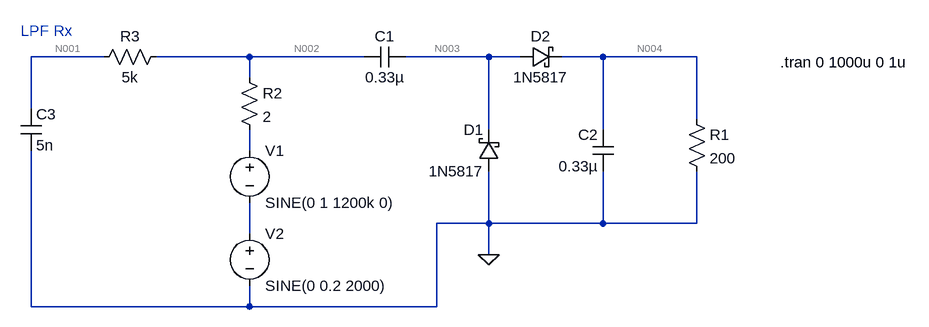
[diagram p0: schematic VoltageDoubler.asc]
VoltageDoubler.asc, the LTspice schematic file:
Version 4
SHEET 1 960 680
WIRE -304 48 -416 48
WIRE -80 48 -224 48
WIRE 96 48 -80 48
WIRE 288 48 160 48
WIRE 336 48 288 48
WIRE 464 48 400 48
WIRE 608 48 464 48
WIRE -80 80 -80 48
WIRE -416 128 -416 48
WIRE 608 144 608 48
WIRE 288 160 288 48
WIRE 464 160 464 48
WIRE -80 192 -80 160
WIRE 288 304 288 224
WIRE 288 304 208 304
WIRE 464 304 464 224
WIRE 464 304 288 304
WIRE 608 304 608 224
WIRE 608 304 464 304
WIRE -80 320 -80 272
WIRE 288 352 288 304
WIRE -416 432 -416 192
WIRE -80 432 -80 400
WIRE -80 432 -416 432
WIRE 208 432 208 304
WIRE 208 432 -80 432
FLAG 288 352 0
SYMBOL voltage -80 176 R0
WINDOW 123 0 0 Left 0
WINDOW 39 0 0 Left 0
SYMATTR InstName V1
SYMATTR Value SINE(0 1 1200k 0)
SYMBOL cap 160 32 R90
WINDOW 0 0 32 VBottom 2
WINDOW 3 32 32 VTop 2
SYMATTR InstName C1
SYMATTR Value 0.33µ
SYMBOL cap 480 224 R180
WINDOW 0 24 56 Left 2
WINDOW 3 24 8 Left 2
SYMATTR InstName C2
SYMATTR Value 0.33µ
SYMBOL schottky 304 224 R180
WINDOW 0 24 64 Left 2
WINDOW 3 24 0 Left 2
SYMATTR InstName D1
SYMATTR Value 1N5817
SYMATTR Description Diode
SYMATTR Type diode
SYMBOL schottky 336 64 R270
WINDOW 0 32 32 VTop 2
WINDOW 3 0 32 VBottom 2
SYMATTR InstName D2
SYMATTR Value 1N5817
SYMATTR Description Diode
SYMATTR Type diode
SYMBOL res 592 128 R0
SYMATTR InstName R1
SYMATTR Value 200
SYMBOL res -96 64 R0
SYMATTR InstName R2
SYMATTR Value 2
SYMBOL res -208 32 R90
WINDOW 0 0 56 VBottom 2
WINDOW 3 32 56 VTop 2
SYMATTR InstName R3
SYMATTR Value 5k
SYMBOL cap -432 128 R0
SYMATTR InstName C3
SYMATTR Value 5n
SYMBOL voltage -80 304 R0
WINDOW 123 0 0 Left 0
WINDOW 39 0 0 Left 0
SYMATTR InstName V2
SYMATTR Value SINE(0 0.2 2000)
TEXT 736 56 Left 2 !.tran 0 1000u 0 1u
TEXT -432 8 Left 2 ;LPF Rx

The netlist it stands for:
* VoltageDoubler.asc
V1 N005 N006 SINE(0 1 1200k 0)
C1 N003 N002 0.33µ
C2 0 N004 0.33µ
D1 0 N003 1N5817
D2 N003 N004 1N5817
R1 N004 0 200
R2 N002 N005 2
R3 N002 N001 5k
C3 N001 0 5n
V2 N006 0 SINE(0 0.2 2000)
.model D D
.lib standard.dio
.tran 0 1000u 0 1u
* LPF Rx
.backanno
.end

* Results of the author's LTspice run, read from the files saved beside the schematic
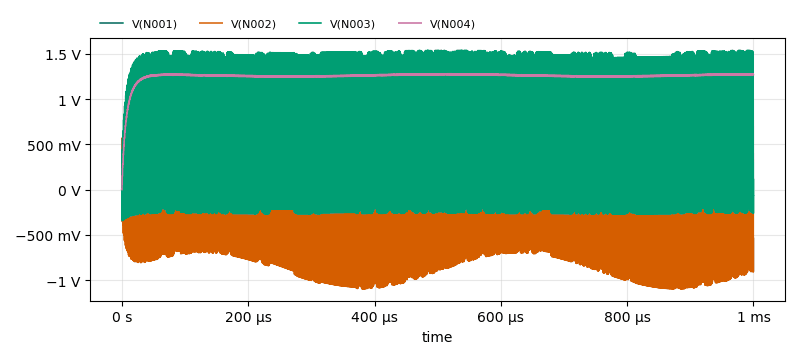
[diagram p1: Transient Analysis of VoltageDoubler.asc, plotted from the saved traces]
* Transient Analysis, 1 run:
*   V(N001): min -195.6 mV, max 195.8 mV, average 2.019 mV, rms 135.2 mV, last -63.73 mV
*   V(N002): min -1.096 V, max 1.099 V, average 414.2 µV, rms 683.3 mV, last -4.895 mV
*   V(N003): min -346.4 mV, max 1.541 V, average 626.1 mV, rms 916.1 mV, last 647.9 mV
*   V(N004): min 0 V, max 1.282 V, average 1.253 V, rms 1.255 V, last 1.271 V